# EAGLE design 2 x Stepper Motoren Midi Board_01 (EAGLE 6.5.0)
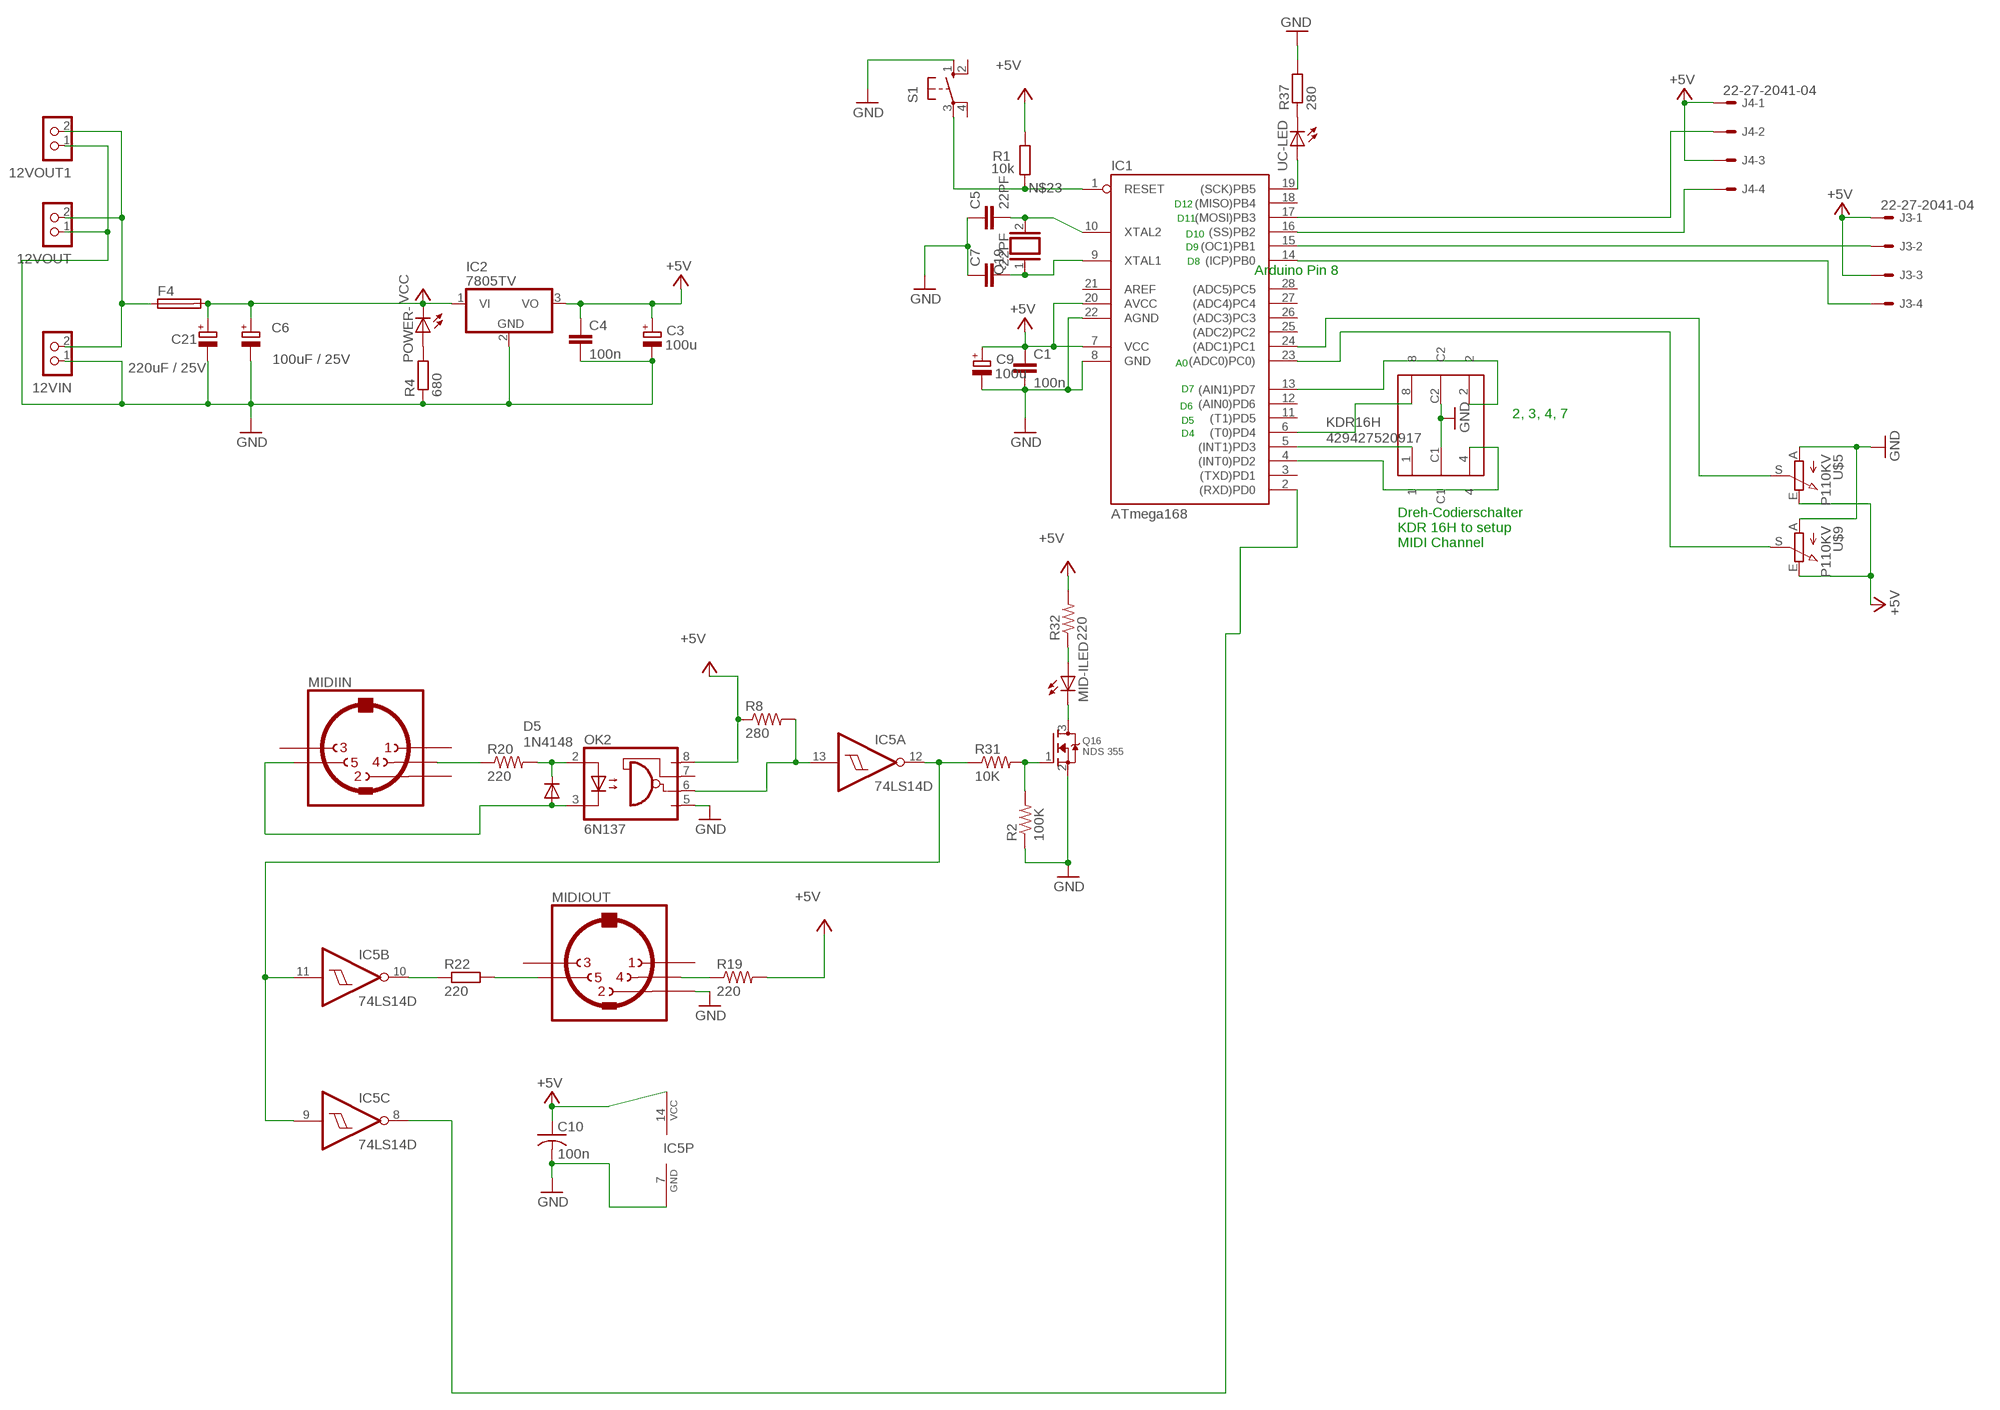
[diagram p0: schematic, sheet 1]

## Parts
12VIN  CON_TERMINAL_BLOCK_02-5MM  [TERMINAL_BLOCK_2P_5]
12VOUT  CON_TERMINAL_BLOCK_02-5MM  [TERMINAL_BLOCK_2P_5]
12VOUT1  CON_TERMINAL_BLOCK_02-5MM  [TERMINAL_BLOCK_2P_5]
C1  100n  C-EUC0805K  [C0805K]
C3  100u  CPOL-EUE2.5-7  [E2,5-7]
C4  100n  C-EUC0805K  [C0805K]
C5  22PF  C-EUC0805  [C0805]
C6  100uF / 25V  CPOL-EUE2.5-7  [E2,5-7]
C7  22PF  C-EUC0805  [C0805]
C9  100u  CPOL-EUE2.5-6  [E2,5-6]
C10  100n  C-USC0805  [C0805]
C21  220uF / 25V  CPOL-EUE5-8.5  [E5-8,5]
D5  1N4148  DIODE-D-7.5  [D-7.5]
F4  SH22,5  [SH22,5]
IC1  ATmega168  AT90S4433P  [DIL28-3]
IC2  7805TV  [TO220V]
IC5  74LS14D  [SO14]
J3  22-27-2041-04  [6410-04]
J4  22-27-2041-04  [6410-04]
KDR16H  429427520917  [429427520917]
MID-ILED  LED3MM  [LED3MM]
MIDIIN  MAB5SH  [MAB5SH]
MIDIOUT  MAB5SH  [MAB5SH]
OK2  6N137  [DIL08]
POWER-  LED3MM  [LED3MM]
Q16  NDS 355  MOSFET-NWAVE  [SOT23-W]
Q19  XTAL/S  [QS]
R1  10k  R-EU_R0805  [R0805]
R2  100K  R-US_R0805W  [R0805W]
R4  680  R-EU_R0805W  [R0805W]
R8  280  R-US_M0805  [M0805]
R19  220  R-US_R0805W  [R0805W]
R20  220  R-US_R0805  [R0805]
R22  220  R-EU_R0805  [R0805]
R31  10K  R-US_R0805W  [R0805W]
R32  220  R-US_R0805W  [R0805W]
R37  280  R-EU_R0805  [R0805]
S1  10-XX  [B3F-10XX]
U$5  P110KV  [POT-P110KV]
U$9  P110KV  [POT-P110KV]
UC-LED  LED3MM  [LED3MM]

## Nets
+5V [power]: C1.1 C3.+ C4.1 C9.+ C10.1 IC1.7(VCC) IC1.20(AVCC) IC2.3(VO) IC5.14(P:VCC) J3.1 J3.3 J4.1 J4.3 OK2.8(VCC) R1.2 R8.1 R19.2 R32.2 U$5.E U$9.E
A1_IN: IC1.24((ADC1)PC1) U$5.S
A2_IN: IC1.23((ADC0)PC0)) U$9.S
GND [power]: 12VIN.1 12VOUT1.1 12VOUT.1 C1.2 C3.- C4.2 C5.1 C6.- C7.1 C9.- C10.2 C21.- IC1.8(GND) IC1.22(AGND) IC2.2(GND) IC5.7(P:GND) KDR16H.C1 KDR16H.C2 MIDIOUT.2 OK2.5(GND) Q16.2(S) R2.1 R4.1 R37.2 S1.1(S) U$5.A U$9.A
MIDI_IN1: IC5.9(C:I) IC5.11(B:I) IC5.12(A:O) R31.1
N$1: IC1.15((OC1)PB1) J3.2
N$2: IC1.14((ICP)PB0) J3.4
N$3: POWER-.A R4.2
N$4: IC1.16((SS)PB2) J4.4
N$5: 12VIN.2 12VOUT1.2 12VOUT.2 F4.1
N$6: C7.2 IC1.9(XTAL1) Q19.1
N$7: C5.2 IC1.10(XTAL2) Q19.2
N$8: IC1.17((MOSI)PB3) J4.2
N$23: IC1.1(RESET) R1.1 S1.3(P)
N$24: IC1.2((RXD)PD0) IC5.8(C:O)
N$26: MIDIOUT.4 R19.1
N$27: IC5.13(A:I) OK2.6(VO) R8.2
N$29: D5.A MIDIIN.5 OK2.3(C)
N$31: D5.C OK2.2(A) R20.2
N$32: IC5.10(B:O) R22.1
N$33: MIDIOUT.5 R22.2
N$39: R37.1 UC-LED.K(C)
N$46: Q16.1(G) R2.2 R31.2
N$47: MID-ILED.K(C) Q16.3(D)
N$48: MID-ILED.A R32.1
N$49: MIDIIN.4 R20.1
N$50: IC1.19((SCK)PB5) UC-LED.A
N$79: IC1.13((AIN1)PD7) KDR16H.2
N$80: IC1.6((T0)PD4) KDR16H.8
N$81: IC1.5((INT1)PD3) KDR16H.1
N$82: IC1.4((INT0)PD2) KDR16H.4
VCC: C6.+ C21.+ F4.2 IC2.1(VI) POWER-.K(C)
Unconnected: IC1.3((TXD)PD1) IC1.11((T1)PD5) IC1.12((AIN0)PD6) IC1.18((MISO)PB4) IC1.21(AREF) IC1.25((ADC2)PC2) IC1.26((ADC3)PC3) IC1.27((ADC4)PC4) IC1.28((ADC5)PC5) IC5.1(D:I) IC5.2(D:O) IC5.3(E:I) IC5.4(E:O) IC5.5(F:I) IC5.6(F:O) MIDIIN.1 MIDIIN.2 MIDIIN.3 MIDIOUT.1 MIDIOUT.3 OK2.7(VE) S1.2(S1) S1.4(P1)

## Notes on the sheet
- D12
- D11
- D10
- D9
- D8
- Arduino Pin 8
- A0
- D7
- D6
- 2, 3, 4, 7
- D5
- D4
- Dreh-Codierschalter 
  KDR 16H to setup 
  MIDI Channel

## Library data of the parts
12VIN 12VOUT 12VOUT1 = dp_devices:CON_TERMINAL_BLOCK_02: 2 poles wire to board terminal block
C1 C4 = my-rcl:C-EU: CAPACITOR, European symbol
C3 C6 C9 = my-rcl:CPOL-EU: POLARIZED CAPACITOR, European symbol
C5 C7 = rcl:C-EU: CAPACITOR, European symbol
C10 = rcl:C-US: CAPACITOR, American symbol
C21 = rcl:CPOL-EU: POLARIZED CAPACITOR, European symbol
D5 = diode:DIODE-: DIODE
F4 = fuse:SH22,5: FUSE HOLDER grid 22,5 mm, OGN0031 8201, Schurter (Buerklin); MF: SCHURTER; MPN: 0031.8201; OC_FARNELL: 1162740; OC_NEWARK: 96F8317
IC1 = atmel:AT90S4433: MICROCONTROLLER 4 Kbytes FLASH 128 bytes SRAM 256 bytes EEPROM UART 6-channel 10 bit ADC
IC2 = linear:78*: Positive VOLTAGE REGULATOR Source: http://cache.national.com/ds/LM/LM78L05.pdf http://www.fairchildsemi.com/ds/LM/LM7805.pdf
IC5 = 74xx-us:74*14: Hex schmitt trigger INVERTER
J3 J4 = con-molex:22-?-04: CONNECTOR wire to board 2.54 mm (.1 inch) pitch header; OC_FARNELL: unknown; OC_NEWARK: unknown
KDR16H = Eagle_Wuerth_Elektronik_Switch:429427520917: WS-RCT, 10*10mm Rotary Switch, right angle type, THT, 16 position, 5,08mm, 6 pins, round Cross type, ivory, complement code
MID-ILED POWER- UC-LED = led:LED: LED OSRAM: - CHIPLED LG R971, LG N971, LY N971, LG Q971, LY Q971, LO R971, LY R971 LH N974, LH R974 LS Q976, LO Q976, LY Q976 LO Q996 - Hyper CHIPLED LW Q18S LB Q993, LB Q99A, LB R99A - SideLED LS A670, LO A670, LY A670, LG A670, LP A670 LB A673, LV A673, LT A673, LW A673 LH A674 LY A675 LS A676, LA A676, LO A676, LY A676, LW A676 LS A679, LY A679, LG A679 - Hyper Micro SIDELED® LS Y876, LA Y876, LO Y876, LY Y876 LT Y87S - SmartLED LW L88C, LW L88S LB L89C, LB L89S, LG L890 LS L89K, LO L89K, LY L89K LS L896, LA L896, LO L896, LY L896 - TOPLED LS T670, LO T670, LY T670, LG T670, LP T670 LSG T670, LSP T670, LSY T670, LOP T670, LYG T670 LG T671, LOG T671, LSG T671 LB T673, LV T673, LT T673, LW T673 LH T674 LS T676, LA T676, LO T676, LY T676, LB T676, LH T676, LSB T676, LW T676 LB T67C, LV T67C, LT T67C, LS T67K, LO T67K, LY T67K, LW E67C LS E67B, LA E67B, LO E67B, LY E67B, LB E67C, LV E67C, LT E67C LW T67C LS T679, LY T679, LG T679 LS T770, LO T770, LY T770, LG T770, LP T770 LB T773, LV T773, LT T773, LW T773 LH T774 LS E675, LA E675, LY E675, LS T675 LS T776, LA T776, LO T776, LY T776, LB T776 LHGB T686 LT T68C, LB T68C - Hyper Mini TOPLED® LB M676 - Mini TOPLED Santana® LG M470 LS M47K, LO M47K, LY M47K Source: http://www.osram.convergy.de LUXEON: - LUMILED® LXK2-PW12-R00, LXK2-PW12-S00, LXK2-PW14-U00, LXK2-PW14-V00 LXK2-PM12-R00, LXK2-PM12-S00, LXK2-PM14-U00 LXK2-PE12-Q00, LXK2-PE12-R00, LXK2-PE12-S00, LXK2-PE14-T00, LXK2-PE14-U00 LXK2-PB12-K00, LXK2-PB12-L00, LXK2-PB12-M00, LXK2-PB14-N00, LXK2-PB14-P00, LXK2-PB14-Q00 LXK2-PR12-L00, LXK2-PR12-M00, LXK2-PR14-Q00, LXK2-PR14-R00 LXK2-PD12-Q00, LXK2-PD12-R00, LXK2-PD12-S00 LXK2-PH12-R00, LXK2-PH12-S00 LXK2-PL12-P00, LXK2-PL12-Q00, LXK2-PL12-R00 Source: www.luxeon.com KINGBRIGHT: KA-3528ASYC Source: www.kingbright.com
MIDIIN MIDIOUT = og-midi:MAB5SH: Female CONNECTOR 5 pins 90 deg. with shield, horizontal (DIN 41524)
OK2 = optocoupler:6N137: MOTOROLA OPTO COUPLER; MPN: 6N137; OC_FARNELL: 1328376; OC_NEWARK: 52M1895
Q16 = adafruit:MOSFET-N: N-Channel Mosfet 2N7002E - 60V 260mA SOT23 [Digikey: 2N7002ET1GOSTR-ND] - REEL BSH103 - 30V 850mA SOT23 [Digikey: 568-5013-1-ND]
Q19 = special:XTAL/S: CRYSTAL
R1 R4 R22 R37 = rcl:R-EU_: RESISTOR, European symbol
R2 R8 R19 R20 R31 R32 = rcl:R-US_: RESISTOR, American symbol
S1 = switch-omron:10-XX: OMRON SWITCH; MPN: B3F-1000; OC_FARNELL: 176432; OC_NEWARK: 36M3542
U$5 U$9 = Moritz_02:P110KV

## Net classes
1 power: width 0.6 mm, clearance 0.3 mm

## Board
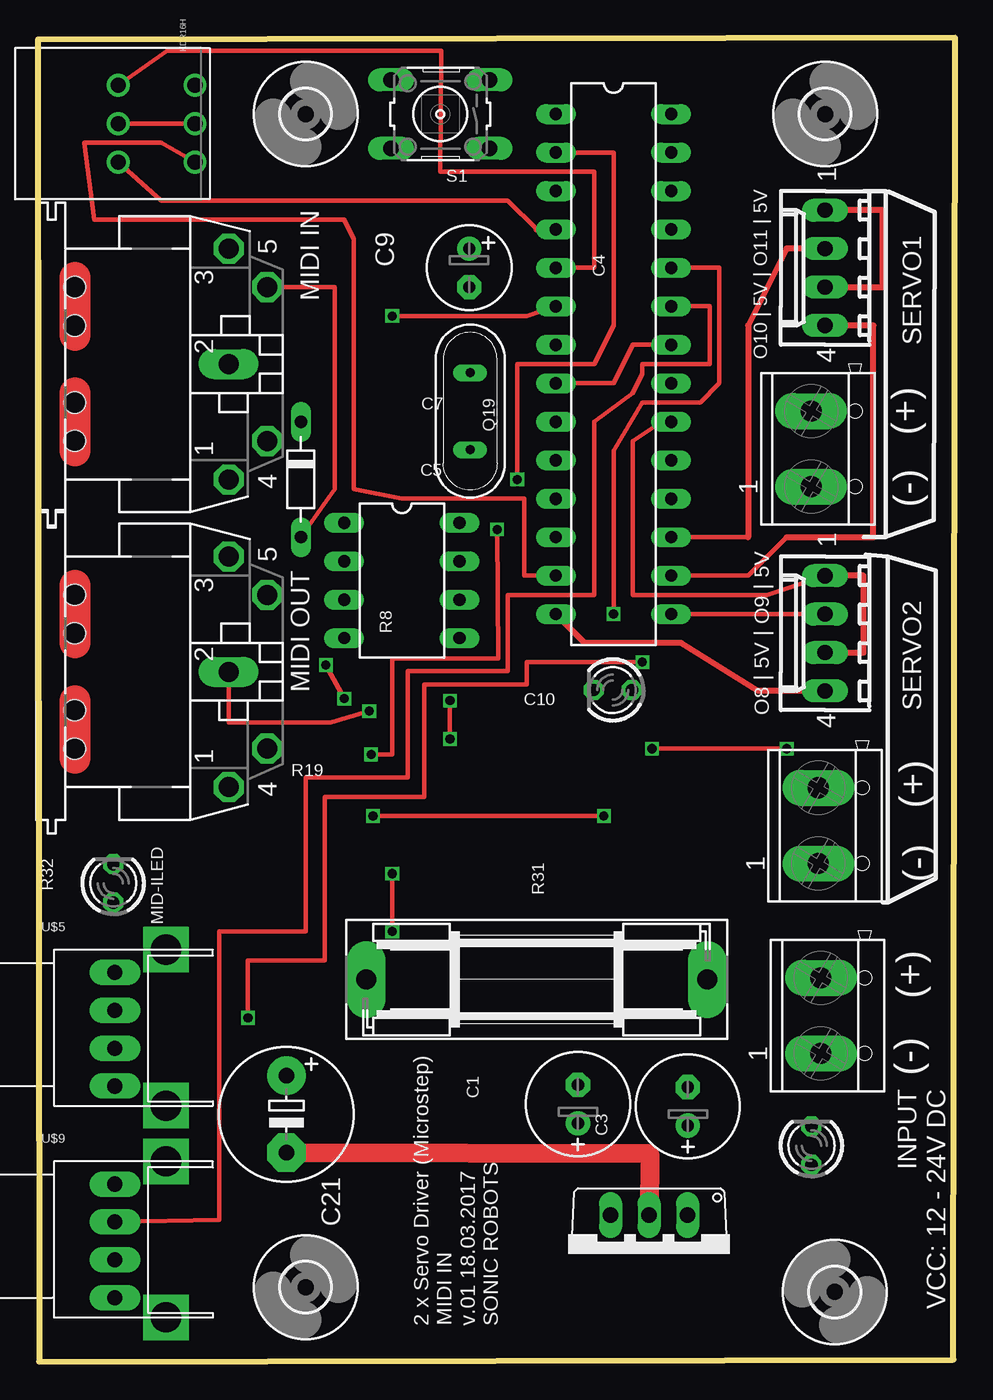
[diagram p1: board, top side]
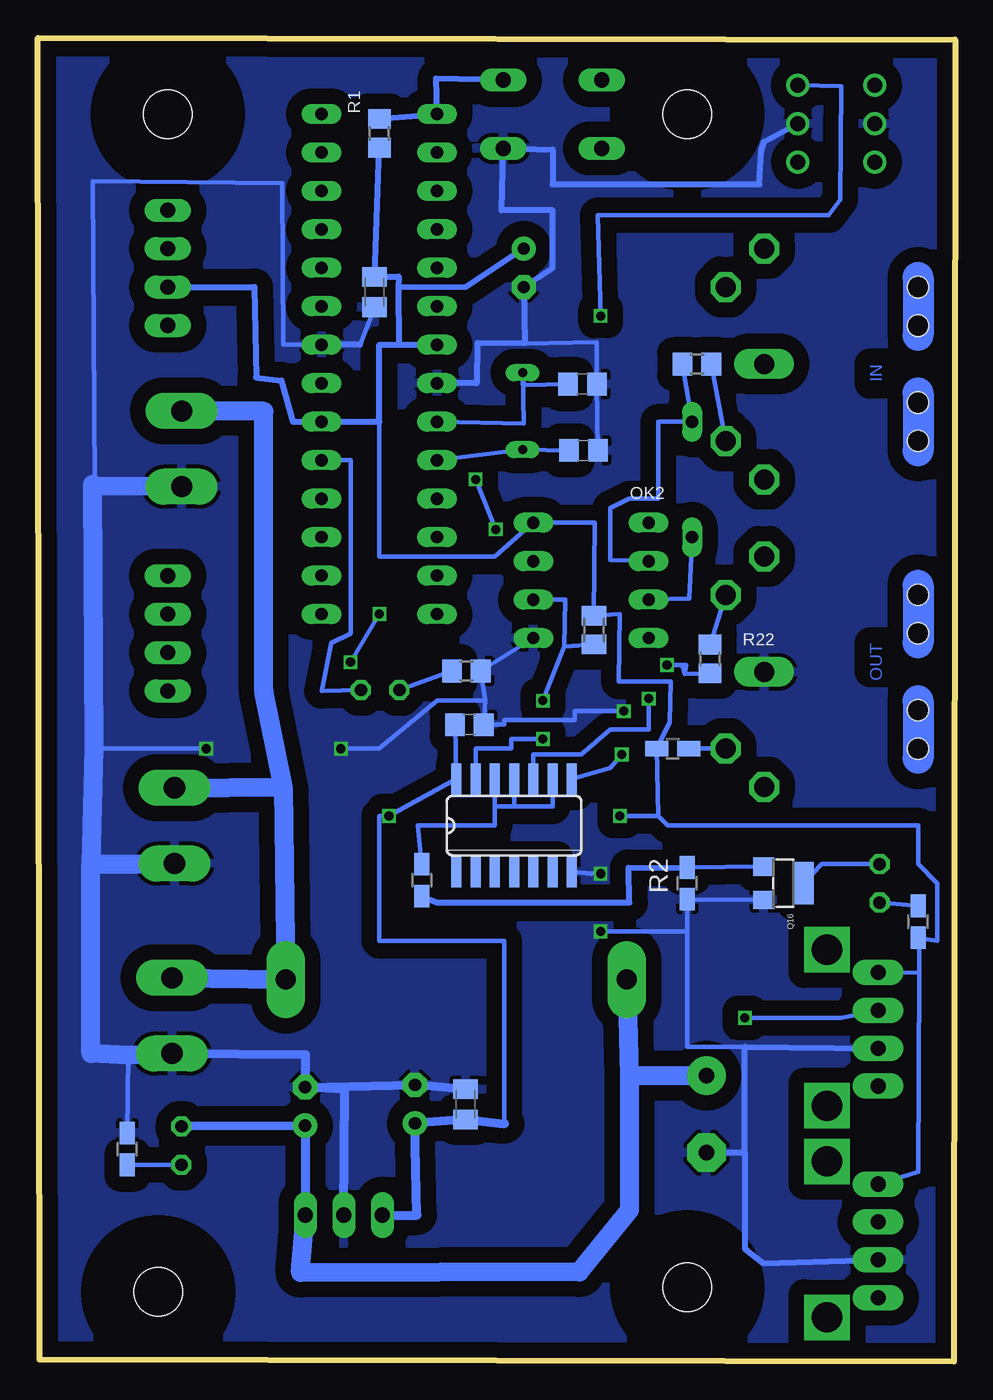
[diagram p2: board, bottom side, seen from below]

Size 60.54 x 87.41 mm. Coordinates in mm from the lower left corner, seen from the top.
Outline: 0,87.3 0.08,0 60.43,0.14 60.54,87.41 0,87.3
Copper layers (1*16): Top 0.035mm / dielectric 1.5mm / Bottom 0.035mm
Design rules "dirt_cheap_dirty_boards.v1": minimum track width 5mil, minimum drill 12mil, track to track 5mil, track to pad 5mil, pad to pad 5mil, via to via 5mil, smd to smd 0mil, copper to edge 10mil, drill to drill 10mil, minimum pad ring 10mil, minimum via ring 6mil, stop-mask expansion 2mil, vias tented up to drill 25mil, thermal gap 10mil

### Footprints (pad centres in the part's own frame; a part is rotated, then mirrored left to right if it is on the bottom)
TERMINAL_BLOCK_2P_5 = drill 1.4 pad 2.38 long: 1 2.5,-0.45; 2 -2.5,-0.45
C0805K = smd 1.3 x 1.6: 1 -1,0; 2 1,0
E2,5-7 = drill 0.813 pad 1.6: + -1.27,0 | drill 0.813 pad 1.6 octagon: - 1.27,0
C0805 = smd 1.3 x 1.5: 1 -0.95,0; 2 0.95,0
E2,5-6 = drill 0.813 pad 1.6: + -1.27,0 | drill 0.813 pad 1.6 octagon: - 1.27,0
E5-8,5 = drill 1.016 pad 2.54: + -2.54,0 | drill 1.016 pad 2.54 octagon: - 2.54,0
D-7.5 = drill 0.813 long: A 3.81,0; C -3.81,0
SH22,5 = drill 1.321 pad 2.54 long: 1 -11.252,0; 2 11.252,0
DIL28-3 = drill 0.813 long: 1 -16.51,-3.81; 2 -13.97,-3.81; 3 -11.43,-3.81; 4 -8.89,-3.81; 5 -6.35,-3.81; 6 -3.81,-3.81; 7 -1.27,-3.81; 8 1.27,-3.81; 9 3.81,-3.81; 10 6.35,-3.81; 11 8.89,-3.81; 12 11.43,-3.81; 13 13.97,-3.81; 14 16.51,-3.81; 15 16.51,3.81; 16 13.97,3.81; 17 11.43,3.81; 18 8.89,3.81; 19 6.35,3.81; 20 3.81,3.81; 21 1.27,3.81; 22 -1.27,3.81; 23 -3.81,3.81; 24 -6.35,3.81; 25 -8.89,3.81; 26 -11.43,3.81; 27 -13.97,3.81; 28 -16.51,3.81
TO220V = drill 1.016 long: 1 -2.54,-2.54; 2 0,-2.54; 3 2.54,-2.54
SO14 = smd 0.66 x 2.032: 1 -3.81,-3.073; 2 -2.54,-3.073; 3 -1.27,-3.073; 4 0,-3.073; 5 1.27,-3.073; 6 2.54,-3.073; 7 3.81,-3.073; 8 3.81,3.073; 9 2.54,3.073; 10 1.27,3.073; 11 0,3.073; 12 -1.27,3.073; 13 -2.54,3.073; 14 -3.81,3.073
6410-04 = drill 1.016 long: 1 3.81,0; 2 1.27,0; 3 -1.27,0; 4 -3.81,0
429427520917 = drill 1: 1 -2.54,-2.54; 2 2.54,2.54; 4 2.54,-2.54; 8 -2.54,2.54; C1 0,-2.54; C2 0,2.54
LED3MM = drill 0.813 octagon: A -1.27,0; K 1.27,0
MAB5SH = drill 1.321 octagon: 1 7.62,7.62; 3 -7.62,7.62; 4 5.08,10.16; 5 -5.08,10.16 | drill 1.321 long: 2 0,7.62 | hole 1.4: 2.54,-2.54; -2.54,-2.54; -5.08,-2.54; 5.08,-2.54
DIL08 = drill 0.813 long: 1 -3.81,-3.81; 2 -1.27,-3.81; 3 1.27,-3.81; 4 3.81,-3.81; 5 3.81,3.81; 6 1.27,3.81; 7 -1.27,3.81; 8 -3.81,3.81
SOT23-W = smd 1.2 x 1.4: 1 -1.1,-1.3; 2 1.1,-1.3 | smd 2.8 x 1.4: 3 0,1.3
QS = drill 0.61 long: 1 -2.54,0; 2 2.54,0
R0805 = smd 1.3 x 1.5: 1 -0.95,0; 2 0.95,0
R0805W = smd 1.5 x 1: 1 -1.052,0; 2 1.052,0
M0805 = smd 1.3 x 1.6: 1 -0.95,0; 2 0.95,0
B3F-10XX = drill 1.016 long: 1 -3.251,2.261; 2 3.251,2.261; 3 -3.251,-2.261; 4 3.251,-2.261
3,2 = hole 3.2: 0,0
POT-P110KV = drill 1 pad 1.676 long: A -4.98,-2; E -4.98,3; NA -4.98,-4.5; S -4.98,0.5 | drill 2 pad 2.8 square: M1 -1.6,4.5; M2 -1.6,-5.8

### Placement (x,y rotation side)
12VIN  51.5,60.27 270 top
12VOUT  52.13,22.85 270 top
12VOUT1  51.97,35.39 270 top
C1  32.31,16.99 90 bottom
C3  35.65,17.01 90 top
C4  38.32,70.64 270 bottom
C5  24.52,60.17 180 bottom
C6  42.9,16.85 90 top
C7  24.59,64.55 180 bottom
C9  28.47,72.22 270 top
C10  32.05,42.06 0 bottom
C21  16.41,16.34 270 top
D5  17.36,58.25 270 top
F4  32.92,25.23 180 top
IC1  38,65.87 270 top
IC2  40.35,7.14 180 top
IC5  29.11,35.39 0 bottom
J3  51.97,48.09 90 top
J4  51.97,72.22 90 top
KDR16H  7.84,81.75 270 top
MID-ILED  4.98,31.58 90 top
MIDIIN  4.98,65.87 270 top
MIDIOUT  4.98,45.55 270 top
OK2  24.03,51.59 270 top
POWER-  51.07,14.26 90 top
Q16  11.33,31.58 270 bottom
Q19  28.54,62.76 270 top
R1  38,81.11 270 bottom
R2  17.68,31.58 90 bottom
R4  54.64,14.05 270 bottom
R8  23.84,48.31 270 bottom
R19  18.63,40.47 180 bottom
R20  17.04,65.87 180 bottom
R22  16.17,46.41 90 bottom
R31  35.2,31.79 270 bottom
R32  2.44,29.04 270 bottom
R37  32.26,45.61 0 bottom
S1  26.57,82.38 180 top
U$2  [3,2]  51.97,82.38 0 top
U$3  [3,2]  17.68,82.38 0 top
U$4  [3,2]  17.68,4.91 0 top
U$5  10.06,22.69 0 top
U$6  [3,2]  52.6,4.6 90 top
U$9  10.06,8.72 0 top
UC-LED  37.95,44.35 180 top

### Tracks (layer width: path | path; a pad name or v marks a point on that pad's centre or on a via)
+5V  (via drill 0.6)
  Top 0.305: v37.36,36.03 v22.12,36.03 | J3.1 48.16,50.63 39.27,50.63 39.27,60.79 41.17,62.06 IC1.20
  Top 0.406: J3.3 54.51,46.82 54.51,51.9 J3.1 | J4.3 55.78,70.95 55.78,76.03 J4.1
  Bottom 0.305: 38,62.06 38,53.17 30.38,53.17 OK2.8 23.77,55.4 R8.1 22.12,49.36 22.19,44.92 18.76,44.92 18.82,42.25 R19.2 19.58,36.03 | U$9.E 2.44,12.53 2.37,25.68 | U$5.E 2.37,25.68 | 2.37,25.68 2.37,27.99 R32.2 1.17,27.77 1.17,31.58 2.44,32.85 2.44,35.39 18.95,35.39 19.58,36.03 | C10.1 IC5.14 v37.36,36.03 38,36.03 38,27.77 29.74,27.77 29.74,15.71 | v22.12,36.03 19.58,36.03
  Bottom 0.406: J4.3 46.25,70.95 46.13,64.99 44.48,64.8 43.71,62.06 IC1.20 38,62.06 38,67.14 36.73,67.14 | 36.73,67.14 IC1.7 | 36.74,70.93 36.73,71.65 C4.1 R1.2 | 36.74,70.93 36.73,67.14 | C9.+ 32.28,70.95 36.74,70.93
  Bottom 0.61: IC2.3 35.52,9.68 C3.+ C1.1 29.74,15.71
A1_IN  (via drill 0.6)
  Top 0.305: IC1.24 44.98,72.22 44.98,64.6 43.71,63.33 39.9,63.33 38,60.16 v38,49.36 | v39.9,46.19 32.28,46.19 32.28,44.73 25.49,44.73 25.49,37.3 18.95,37.3 18.95,26.5 13.87,26.5 v13.87,22.69
  Bottom 0.305: v38,49.36 v39.9,46.19 | v13.87,22.69 7.52,22.69 U$5.S
A2_IN
  Top 0.305: U$9.S 11.96,9.36 11.96,28.41 17.68,28.41 17.68,38.57 24.41,38.57 24.41,45.62 31.01,45.62 31.01,50.63 36.73,50.63 36.73,62.06 39.27,63.97 39.9,65.24 39.9,65.87 44.35,65.87 44.35,69.68 IC1.23
GND  (via drill 0.6)
  Top 0.305: IC1.8 38,64.6 39.27,67.14 IC1.22 | KDR16H.C1 KDR16H.C2 | v23.39,32.22 v23.39,28.41 | v21.87,42.95 19.33,42.19 12.6,42.19 MIDIOUT.2 | v40.54,40.47 v49.43,40.47
  Top 1.27: C21.- 40.38,13.74 IC2.2
  Bottom 0.305: C5.1 C7.1 23.65,67.34 28.41,67.23 | Q16.2 R2.1 17.68,28.41 | OK2.5 R37.2 31.01,43.65 | v21.87,42.95 25.11,42.95 25.11,42.38 29.74,42.38 29.74,42.06 C10.2 31.01,43.65 | 24.03,32.22 IC5.7 v23.39,32.22 | v23.39,28.41 17.68,28.41 | 17.68,28.41 17.68,20.79 13.87,20.79 | 31.01,43.65 34.19,43.65 38,40.47 v40.54,40.47 | v49.43,40.47 56.85,40.5 | 56.94,57.92 56.79,57.94 56.92,77.94 44.41,77.81 44.35,67.14 39.27,67.14 C4.2 | R4.1 54.57,20.22
  Bottom 0.406: 13.87,13.8 13.87,7.45 12.66,6.5 U$9.A | C21.- 13.87,13.8 | 13.87,13.8 13.87,20.79 U$5.A | 39.27,67.14 IC1.22 | IC1.8 31.59,64.6 31.52,67.27 28.41,67.23 C9.- 26.57,72.22 26.57,76.03 29.93,76.03 S1.1 26.57,80.03 26.57,77.75 12.92,77.75 12.79,79.97 12.6,80.54 KDR16H.C2
  Bottom 0.61: IC2.2 40.28,18 C6.- | C6.- C3.- C1.2 | 12VOUT.1 42.89,20.28 C6.-
  Bottom 1.27: 12VOUT.1 54.57,20.22 57.05,20.35 57.05,32.85 | 57.05,32.85 51.52,32.85 12VOUT1.1 | 12VIN.1 56.54,57.81 56.94,57.92 56.85,40.5 57.05,32.85
  pour Bottom (isolate 1.016): 60.86,87.46 60.86,-0.17 -0.04,-0.23 -0.04,87.4
MIDI_IN1
  Bottom 0.305: R31.1 35.46,35.39 30.38,35.39 30.38,36.66 | 30.38,36.66 IC5.12 | IC5.11 29.11,36.66 | 29.11,36.66 30.38,36.66 | IC5.9 26.57,36.66 29.11,36.66
N$1
  Top 0.305: J3.2 IC1.15
N$2
  Top 0.406: J3.4 47.52,44.28 42.44,47.46 36.09,47.46 IC1.14
N$3
  Bottom 0.305: R4.2 POWER-.A
N$4
  Top 0.305: IC1.16 46.89,51.9 49.43,54.44
  Top 0.406: 49.43,54.44 55.14,54.44 55.14,68.41 J4.4
N$5
  Bottom 1.27: 12VOUT.2 F4.1 44.35,37.93 | 12VOUT1.2 44.35,37.93 | 44.35,37.93 45.62,44.28 45.62,62.76 12VIN.2
N$6
  Bottom 0.305: C7.2 28.47,64.48 Q19.1 28.47,61.94 IC1.9
N$7
  Bottom 0.305: IC1.10 Q19.2 C5.2
N$8
  Top 0.305: 46.89,54.44 IC1.17
  Top 0.406: J4.2 49.43,73.49 46.89,68.41 46.89,54.44
N$23
  Bottom 0.406: R1.1 IC1.1 34.25,84.73 S1.3
N$24  (via drill 0.6)
  Top 0.305: IC1.2 38,79.84 38,68.41 36.73,65.87 31.65,65.87 v31.65,58.25 | v30.32,54.95 30.38,46.44 23.39,46.44 23.39,40.09 v22,40.09
  Bottom 0.305: v31.65,58.25 v30.32,54.95 | v22,40.09 22.76,39.2 IC5.8
N$26
  Bottom 0.305: MIDIOUT.4 R19.1
N$27  (via drill 0.6)
  Top 0.305: v27.2,41.11 v27.2,43.65
  Bottom 0.305: R8.2 25.81,47.21 | OK2.6 25.74,50.32 25.81,47.21 | IC5.13 31.65,40.47 29.3,40.47 29.3,41.11 v27.2,41.11 | v27.2,43.65 25.81,47.21
N$29
  Top 0.305: MIDIIN.5 19.58,70.95 19.58,57.62 D5.A
  Bottom 0.305: D5.A 17.55,50.38 OK2.3
N$31
  Bottom 0.305: R20.2 D5.C 19.58,62.06 19.58,56.98 21.49,56.98 22.76,56.35 22.76,52.92 OK2.2
N$32  (via drill 0.6)
  Top 0.305: v20.22,43.78 v19.01,46
  Bottom 0.305: R22.1 17.85,45.41 | 17.85,45.41 18,46 | IC5.10 27.84,40.09 24.66,40.09 22.76,41.74 20.22,41.74 v20.22,43.78 | v19.01,46 17.74,46 17.85,45.41
N$33
  Bottom 0.305: MIDIOUT.5 R22.2
N$39
  Bottom 0.305: R37.1 UC-LED.K
N$46
  Bottom 0.305: Q16.1 R2.2
  Bottom 0.406: R31.2 34.19,30.31 21.49,30.31 21.55,32.6 R2.2
N$47
  Bottom 0.305: MID-ILED.K 8.79,32.85 Q16.3
N$48
  Bottom 0.305: R32.1 MID-ILED.A
N$49
  Bottom 0.305: R20.1 MIDIIN.4
N$50
  Bottom 0.305: UC-LED.A 41.81,44.28 41.17,47.46 39.9,48.09 39.9,59.52 IC1.19
N$79
  Top 0.305: IC1.13 32.09,51.9 32.09,56.98 24.03,56.98 20.85,57.62 20.85,74.13 20.22,75.4 3.71,75.4 3.07,80.48 8.15,80.48 KDR16H.2
N$80  (via drill 0.6)
  Top 0.305: v23.39,69.05 32.28,69.05 IC1.6
  Bottom 0.305: KDR16H.8 7.52,84.23 7.58,76.73 8.34,75.72 23.58,75.72 v23.39,69.05
N$81
  Top 0.305: KDR16H.1 8.53,86.58 26.63,86.58 26.57,78.57 36.73,78.57 36.73,72.22 IC1.5
N$82
  Top 0.305: KDR16H.4 8.15,76.67 31.01,76.67 32.92,74.76
  Top 0.406: 32.92,74.76 IC1.4
VCC
  Bottom 0.61: IC2.1 C6.+ POWER-.K
  Bottom 1.27: F4.2 21.49,18.88 | C21.+ 21.49,18.88 | 21.49,18.88 21.49,9.99 24.79,5.93 43.21,5.87 IC2.1
(copper drawn outside any net)
  shapes: Bottom circle x4

### Text on the board
Bottom: IN | OUT
tPlace: MIDI IN | SERVO1 | MIDI OUT | SERVO2 | INPUT / VCC: 12 - 24V DC | 2 x Servo Driver (Microstep) / MIDI IN / v.01 18.03.2017 / SONIC ROBOTS
tNames: O10 | 5V | O11 | 5V | (+) | (-) | O8 | 5V | O9 | 5V | (+) | (-) | (+) | (-)